# EAGLE design talking clock V1 (EAGLE 6.3)
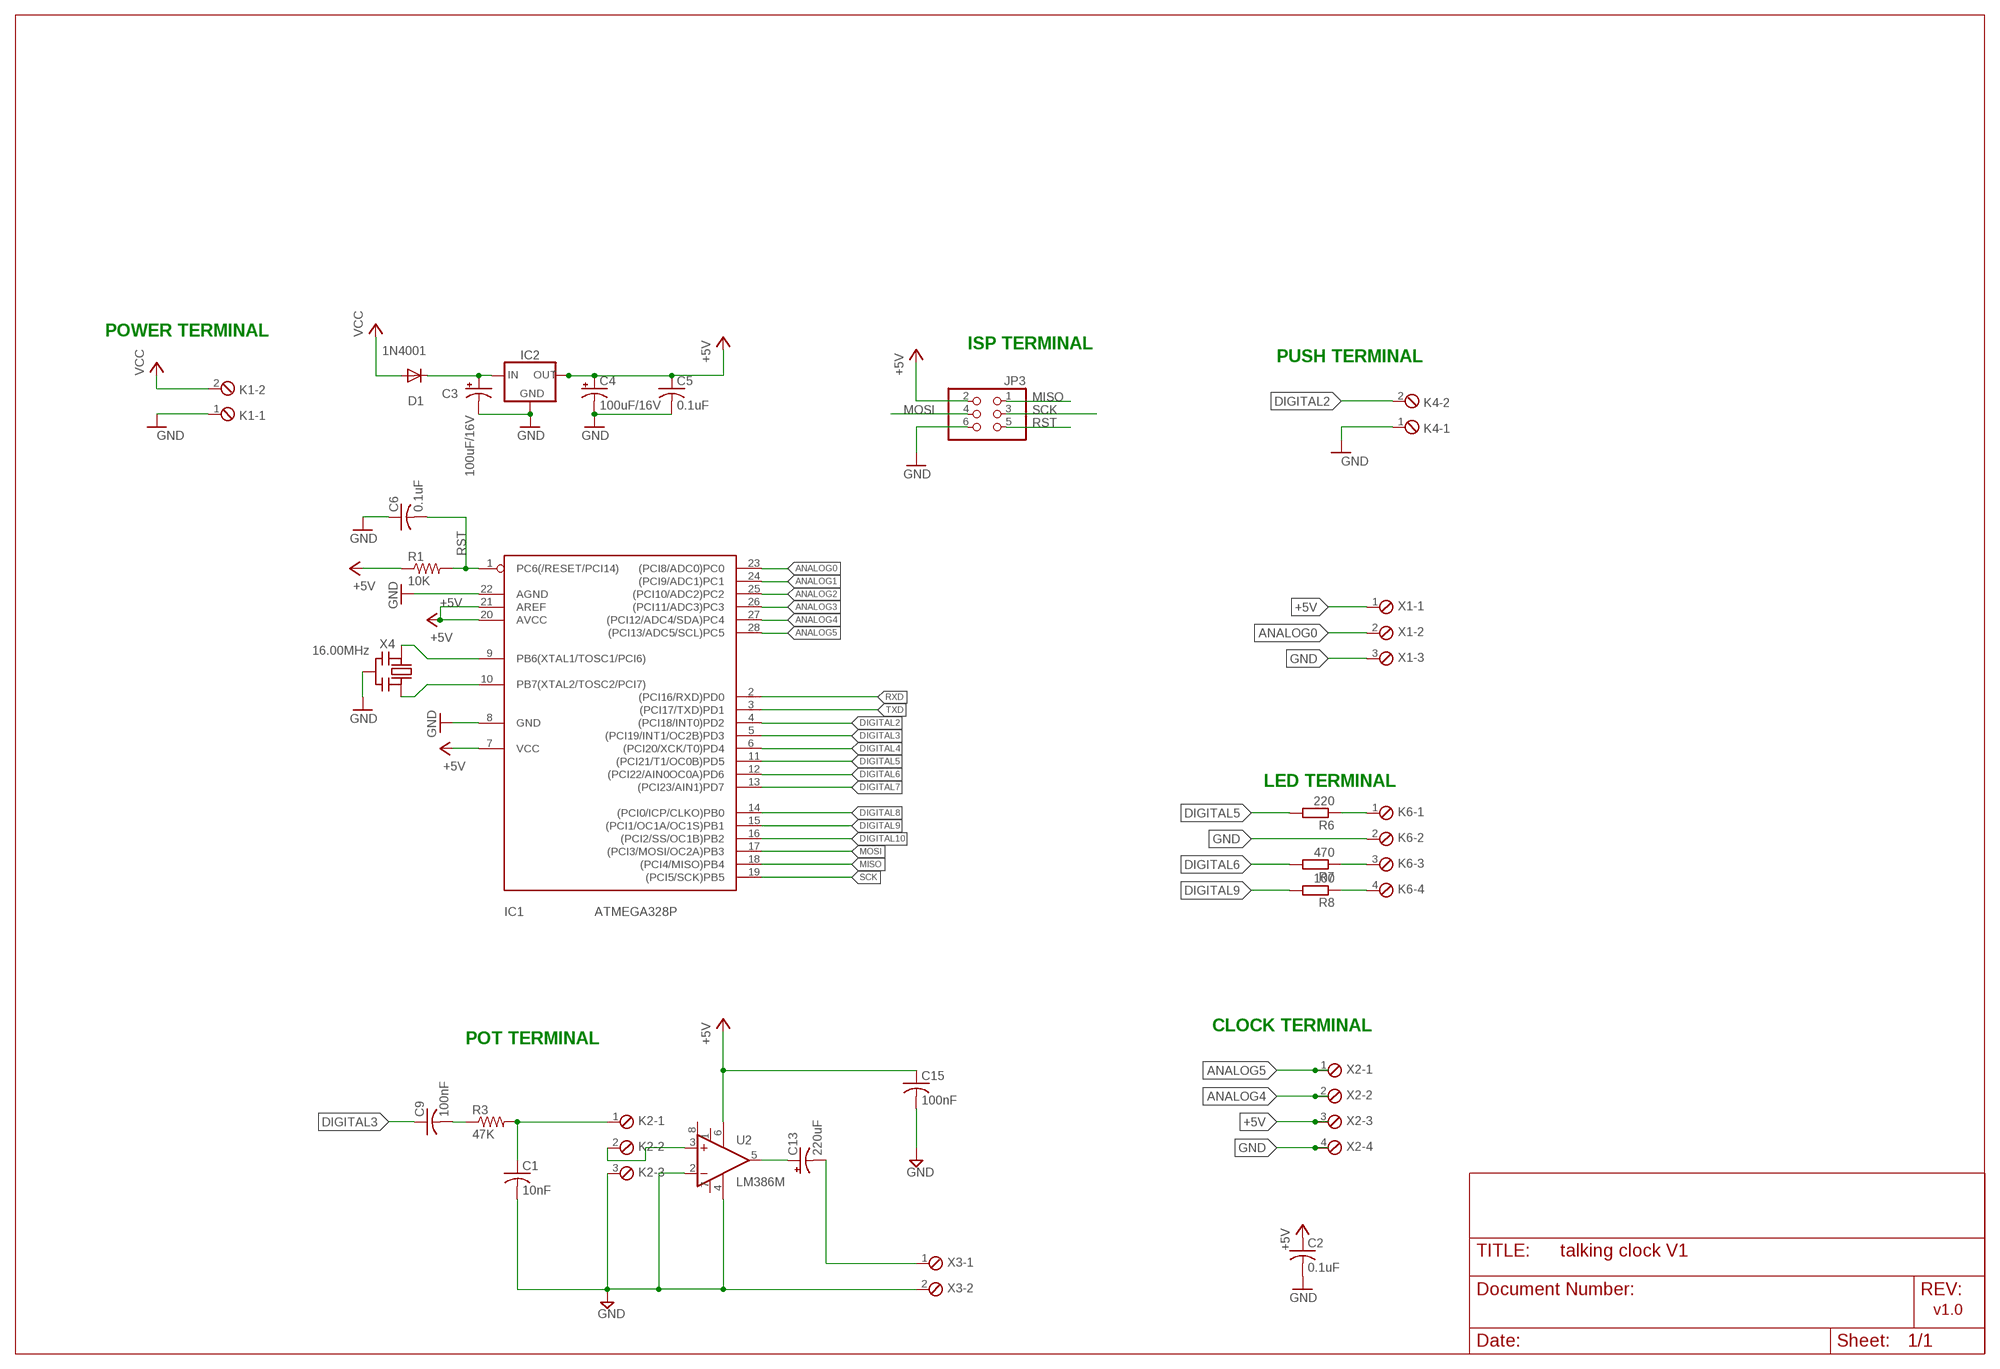
[diagram p0: schematic, sheet 1]

## Parts
C1  10nF  C-US050-025X075  [C050-025X075]
C2  0.1uF  C-US025-025X050  [C025-025X050]
C3  100uF/16V  CPOL-USE2.5-6  [E2,5-6]
C4  100uF/16V  CPOL-USE2.5-6  [E2,5-6]
C5  0.1uF  C-US025-025X050  [C025-025X050]
C6  0.1uF  C-US025-025X050  [C025-025X050]
C9  100nF  C-US025-025X050  [C025-025X050]
C13  220uF  CPOL-USE3.5-10  [E3,5-10]
C15  100nF  C-US025-025X050  [C025-025X050]
D1  1N4001  1N4004  [DO41-10]
IC1  ATMEGA328P  ATMEGA168PROUND  [DIL28/3]
IC2  78L05  78XXS  [78XXS]
JP3  PINHD-2X3  [2X03]
K1  MPT2  [2POL254]
K2  MPT3  [3POL254]
K4  MPT2  [2POL254]
K6  MPT4  [4POL254]
R1  10K  R-US_0207/10  [0207/10]
R3  47K  R-US_0207/10  [0207/10]
R6  220  R-EU_0207/10  [0207/10]
R7  470  R-EU_0207/10  [0207/10]
R8  100  R-EU_0207/10  [0207/10]
U2  LM386M  [SO08]
X1  MPT3  [3POL254]
X2  MPT4  [4POL254]
X3  MPT2  [2POL254]
X4  16.00MHz  CERMOSCILL  [CERM_OSC]

## Nets
+5V: C2.1 C4.+ C5.1 C15.1 IC1.7(VCC) IC1.20(AVCC) IC1.21(AREF) IC2.OUT JP3.2 R1.1 U2.6(V+) X1.1 X2.3
ANALOG0: IC1.23((PCI8/ADC0)PC0) X1.2
ANALOG1: IC1.24((PCI9/ADC1)PC1)
ANALOG2: IC1.25((PCI10/ADC2)PC2)
ANALOG3: IC1.26((PCI11/ADC3)PC3)
ANALOG4: IC1.27((PCI12/ADC4/SDA)PC4) X2.2
ANALOG5: IC1.28((PCI13/ADC5/SCL)PC5) X2.1
DIGITAL2: IC1.4((PCI18/INT0)PD2) K4.2
DIGITAL3: C9.1 IC1.5((PCI19/INT1/OC2B)PD3)
DIGITAL4: IC1.6((PCI20/XCK/T0)PD4)
DIGITAL5: IC1.11((PCI21/T1/OC0B)PD5) R6.2
DIGITAL6: IC1.12((PCI22/AIN0OC0A)PD6) R7.2
DIGITAL7: IC1.13((PCI23/AIN1)PD7)
DIGITAL8: IC1.14((PCI0/ICP/CLKO)PB0)
DIGITAL9: IC1.15((PCI1/OC1A/OC1S)PB1) R8.2
DIGITAL10: IC1.16((PCI2/SS/OC1B)PB2)
GND: C1.2 C2.2 C3.- C4.- C5.2 C6.1 C15.2 IC1.8(GND) IC1.22(AGND) IC2.GND JP3.6 K1.1 K2.3 K4.1 K6.2 U2.2(-IN) U2.4(V-) X1.3 X2.4 X3.2 X4.P$2(GND)
MISO: IC1.18((PCI4/MISO)PB4) JP3.1
MOSI: IC1.17((PCI3/MOSI/OC2A)PB3) JP3.4
N$3: C13.- X3.1
N$4: K2.2 U2.3(+IN)
N$5: C3.+ D1.C IC2.IN
N$6: IC1.9(PB6(XTAL1/TOSC1/PCI6)) X4.P$1(IN)
N$7: IC1.10(PB7(XTAL2/TOSC2/PCI7)) X4.P$3(OUT)
N$10: K6.4 R8.1
N$11: K6.3 R7.1
N$15: K6.1 R6.1
N$16: C9.2 R3.1
N$18: C1.1 K2.1 R3.2
N$25: C13.+ U2.5(OUT)
RST: C6.2 IC1.1(PC6(/RESET/PCI14)) JP3.5 R1.2
RXD: IC1.2((PCI16/RXD)PD0)
SCK: IC1.19((PCI5/SCK)PB5) JP3.3
TXD: IC1.3((PCI17/TXD)PD1)
VCC: D1.A K1.2
Unconnected: U2.1(GAIN+) U2.7(BYPASS) U2.8(GAIN-)

## Notes on the sheet
- POWER TERMINAL
- ISP TERMINAL
- PUSH TERMINAL
- LED TERMINAL
- CLOCK TERMINAL
- POT TERMINAL
- v1.0

## Library data of the parts
C1 C9 C15 = rcl:C-US: CAPACITOR, American symbol
C2 C5 C6 = minimidi:C-US: CAPACITOR, American symbol
C3 C4 = minimidi:CPOL-US: POLARIZED CAPACITOR, American symbol
C13 = rcl:CPOL-US: POLARIZED CAPACITOR, American symbol
D1 = minimidi:1N4004: DIODE general purpose rectifier, 1 A
IC1 = avr:ATMEGA168*P: MICROCONTROLLER 16 kBytes FLASH 1 kBytes SRAM 512 Bytes EEPROM USART 8-channel 10 bit ADC
IC2 = v-reg:78XXS: VOLTAGE REGULATOR
JP3 = pinhead-ez:PINHD-2X3: PIN HEADER
K1 K4 X3 = con-phoenix-254:MPT2: PHOENIX CONNECTOR; OC_FARNELL: unknown; OC_NEWARK: unknown
K2 X1 = con-phoenix-254:MPT3: PHOENIX CONNECTOR; OC_FARNELL: unknown; OC_NEWARK: unknown
K6 X2 = con-phoenix-254:MPT4: PHOENIX CONNECTOR; OC_FARNELL: unknown; OC_NEWARK: unknown
R1 = rcl-ez:R-US_: RESISTOR, American symbol
R3 = rcl:R-US_: RESISTOR, American symbol
R6-R8 = rcl:R-EU_: RESISTOR, European symbol
U2 = mes:LM386
X4 = digg:CERMOSCILL

## Board
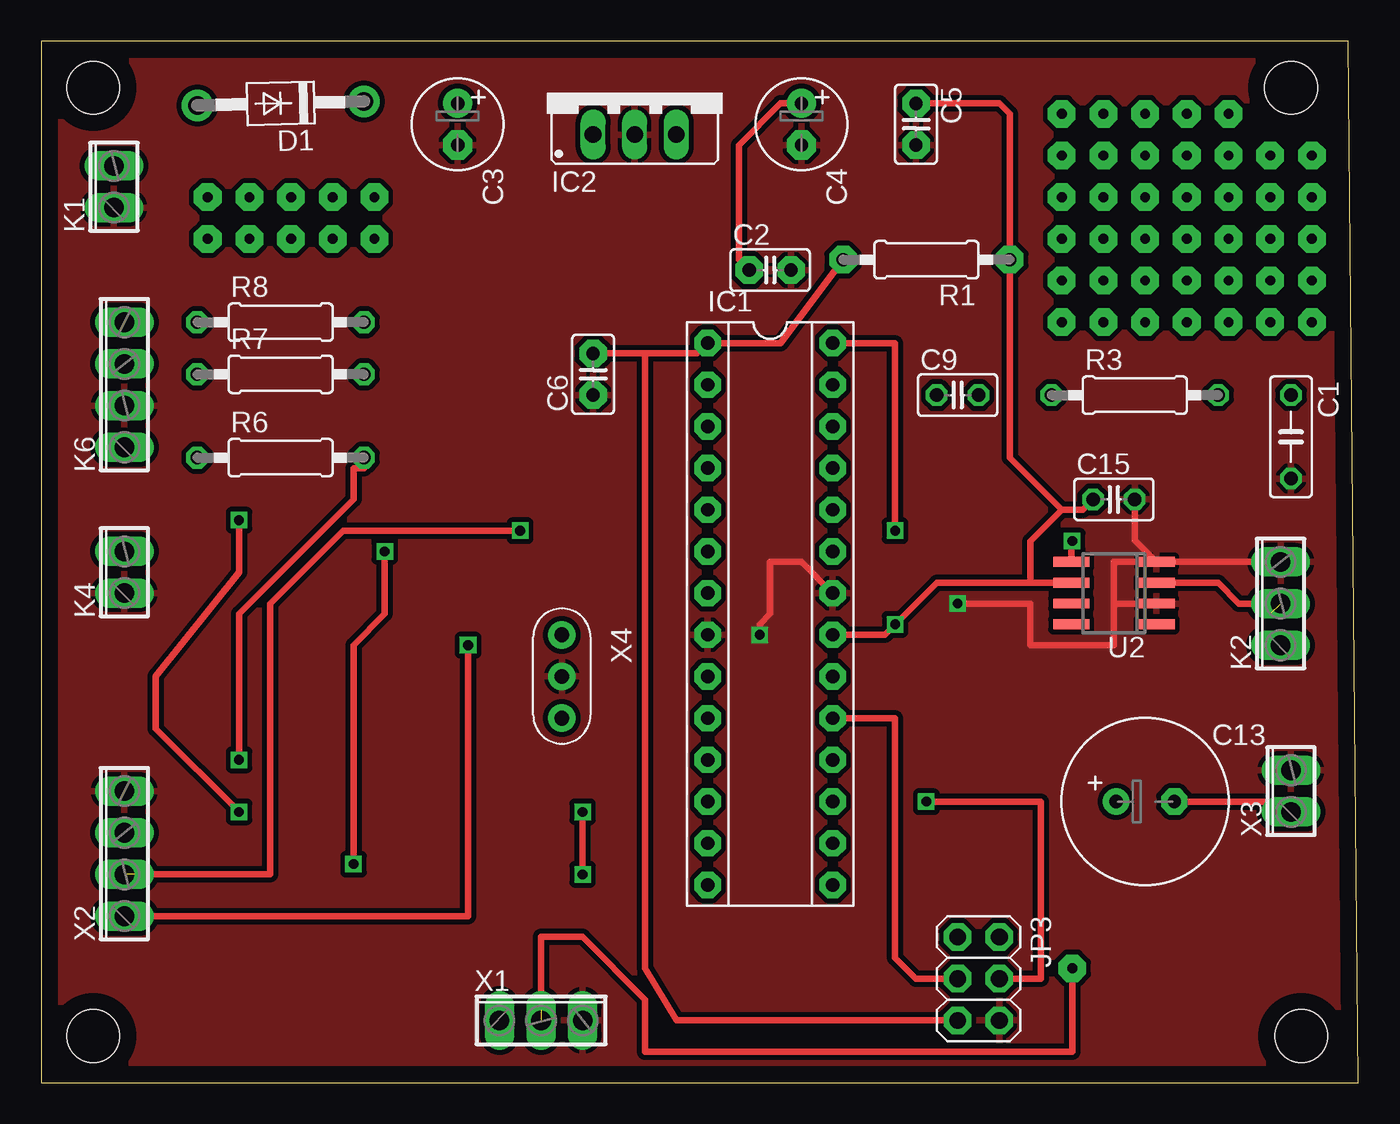
[diagram p1: board, top side]
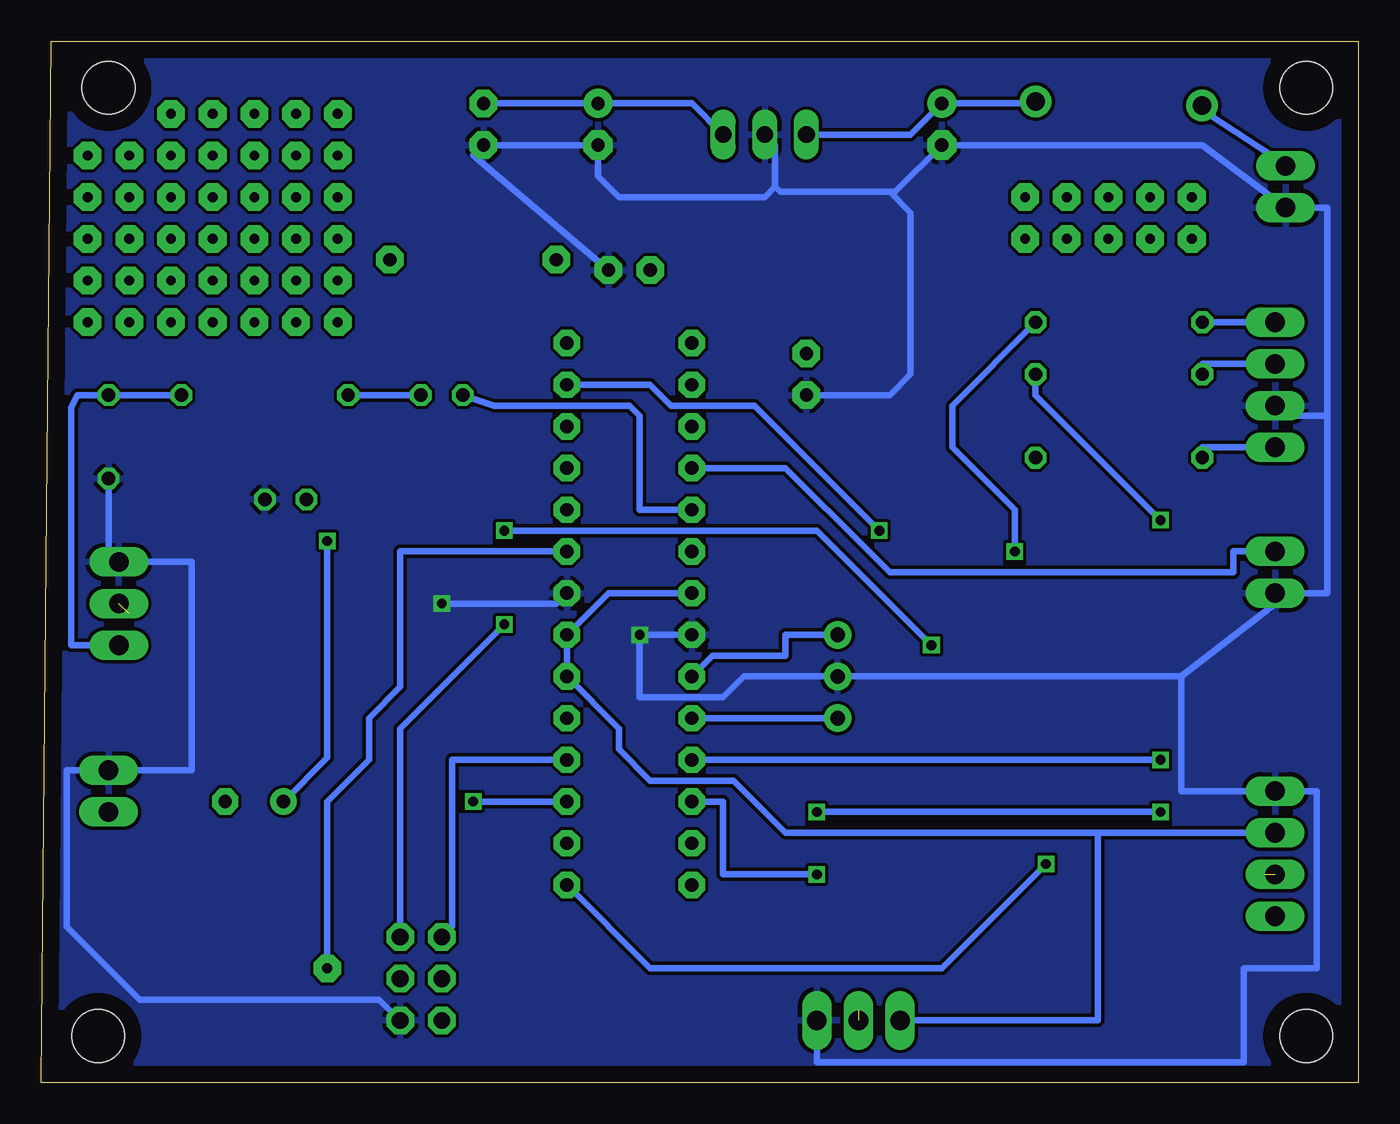
[diagram p2: board, bottom side, seen from below]

Size 80.31 x 63.49 mm. Coordinates in mm from the lower left corner, seen from the top.
Outline: 0,0 80.31,0 79.68,63.49 0,63.49 0,0
Copper layers (1*16): Top 0.035mm / dielectric 1.5mm / Bottom 0.035mm
Design rules "default": minimum track width 16mil, minimum drill 13mil, track to track 8mil, track to pad 8mil, pad to pad 8mil, via to via 8mil, smd to smd 8mil, copper to edge 40mil, drill to drill 8mil, minimum pad ring 10mil, minimum via ring 8mil, stop-mask expansion 4mil, vias tented up to drill 0mil, thermal gap 10mil
Holes 3.2 mm at 3.17,60.64 76.2,60.64 3.17,2.86 76.83,2.86

### Footprints (pad centres in the part's own frame; a part is rotated, then mirrored left to right if it is on the bottom)
C050-025X075 = drill 0.813 octagon: 1 -2.54,0; 2 2.54,0
C025-025X050 = drill 0.813 pad 1.676 octagon: 1 -1.27,0; 2 1.27,0
E2,5-6 = drill 0.813 pad 1.778: + -1.27,0 | drill 0.813 pad 1.778 octagon: - 1.27,0
C025-025X050' = drill 0.813 octagon: 1 -1.27,0; 2 1.27,0
E3,5-10 = drill 0.813 pad 1.6: + -1.778,0 | drill 0.813 pad 1.6 octagon: - 1.778,0
DO41-10 = drill 1.118 pad 1.93: A 5.08,0; C -5.08,0
DIL28/3 = drill 0.813 pad 1.6 octagon: 1 -16.51,-3.81; 2 -13.97,-3.81; 3 -11.43,-3.81; 4 -8.89,-3.81; 5 -6.35,-3.81; 6 -3.81,-3.81; 7 -1.27,-3.81; 8 1.27,-3.81; 9 3.81,-3.81; 10 6.35,-3.81; 11 8.89,-3.81; 12 11.43,-3.81; 13 13.97,-3.81; 14 16.51,-3.81; 15 16.51,3.81; 16 13.97,3.81; 17 11.43,3.81; 18 8.89,3.81; 19 6.35,3.81; 20 3.81,3.81; 21 1.27,3.81; 22 -1.27,3.81; 23 -3.81,3.81; 24 -6.35,3.81; 25 -8.89,3.81; 26 -11.43,3.81; 27 -13.97,3.81; 28 -16.51,3.81
78XXS = drill 1.016 long: GND 0,-2.54; IN -2.54,-2.54; OUT 2.54,-2.54
2X03 = drill 1.016 pad 1.676 octagon: 1 -2.54,-1.27; 2 -2.54,1.27; 3 0,-1.27; 4 0,1.27; 5 2.54,-1.27; 6 2.54,1.27
2POL254 = drill 1.2 long: 1 -1.27,0; 2 1.27,0
3POL254 = drill 1.2 long: 1 -2.54,0; 2 0,0; 3 2.54,0
4POL254 = drill 1.2 long: 1 -3.81,0; 2 -1.27,0; 3 1.27,0; 4 3.81,0
0207/10 = drill 0.813 pad 1.676 octagon: 1 -5.08,0; 2 5.08,0
0207/10' = drill 0.813 octagon: 1 -5.08,0; 2 5.08,0
SO08 = smd 0.6 x 2.2: 1 -1.905,-2.6; 2 -0.635,-2.6; 3 0.635,-2.6; 4 1.905,-2.6; 5 1.905,2.6; 6 0.635,2.6; 7 -0.635,2.6; 8 -1.905,2.6
CERM_OSC = drill 0.9 pad 1.676: P$1 -2.54,0; P$2 0,0; P$3 2.54,0

### Placement (x,y rotation side)
C1  76.2,39.37 270 top
C2  44.45,49.53 0 top
C3  25.4,58.42 270 top
C4  46.35,58.42 270 top
C5  53.34,58.42 270 top
C6  33.66,43.18 90 top
C9  100nF  [C025-025X050']  55.88,41.91 0 top
C13  67.31,17.14 0 top
C15  100nF  [C025-025X050']  65.41,35.56 0 top
D1  14.61,59.69 181.4 top
IC1  44.45,28.57 270 top
IC2  36.2,60.33 0 top
JP3  57.15,6.35 270 top
K1  4.45,54.61 90 top
K2  75.56,29.21 90 top
K4  5.08,31.11 90 top
K6  5.08,42.55 90 top
R1  53.98,50.16 180 top
R3  47K  [0207/10']  66.67,41.91 0 top
R6  220  [0207/10']  14.61,38.1 0 top
R7  470  [0207/10']  14.61,43.18 0 top
R8  100  [0207/10']  14.61,46.35 0 top
U2  65.41,29.84 90 top
X1  30.48,3.81 0 top
X2  5.08,13.97 90 top
X3  76.2,17.78 90 top
X4  31.75,24.77 270 top

### Tracks (layer width: path | path; a pad name or v marks a point on that pad's centre or on a via)
+5V  (via drill 0.6)
  Top 0.406: U2.6 60.33,30.48 | 60.33,30.48 60.33,33.02 62.23,34.92 | 62.23,34.92 63.5,34.92 C15.1 | 60.33,30.48 54.61,30.48 52.39,28.26 | 52.39,28.26 v52.07,27.94 | v52.07,27.94 51.44,27.3 IC1.21 | 62.23,34.92 59.05,38.1 59.05,46.99 59.05,48.26 R1.1 59.05,59.05 58.42,59.69 C5.1 | C4.+ 45.09,59.69 42.55,57.15 42.55,50.16 C2.1 | v52.07,27.94 52.39,28.26
  Bottom 0.406: IC2.OUT 40.64,59.69 C4.+ C5.1 | IC1.7 45.72,29.84 IC1.21 IC1.20 45.09,21.59 45.09,20.32 43.18,18.41 38.1,18.41 34.92,15.24 15.88,15.24 | JP3.2 58.42,21.59 v52.07,27.94 | X2.3 15.88,15.24 | X1.1 15.88,3.81 15.88,15.24
ANALOG0  (via drill 0.6 pad 1.68)  (1 unrouted)
  Top 0.406: v62.87,6.99 62.87,1.91 36.83,1.91 36.83,5.08 33.02,8.89 30.48,8.89 30.48,4.45
  Bottom 0.406: IC1.23 57.78,32.38 58.42,32.38 58.42,25.4 58.42,24.13 60.33,22.23 60.33,19.68 62.87,17.14 v62.87,6.99
ANALOG4  (via drill 0.6)  (1 unrouted)
  Top 0.406: v29.21,33.66 18.41,33.66 13.97,29.21 13.97,14.61 13.97,12.7 10.16,12.7 9.53,12.7 5.71,12.7
  Bottom 0.406: IC1.27 43.18,42.55 41.91,41.27 36.83,41.27 32.38,36.83 v29.21,33.66
ANALOG5  (via drill 0.6)
  Top 0.406: IC1.28 52.07,45.09 v52.07,33.66 | v26.04,26.67 26.04,10.16 X2.1
  Bottom 0.406: v52.07,33.66 33.02,33.66 v26.04,26.67
DIGITAL2
  Bottom 0.406: K4.2 7.62,32.38 7.62,31.11 28.57,31.11 29.84,32.38 34.92,37.47 IC1.4
DIGITAL3
  Bottom 0.406: C9.1 52.7,41.27 44.45,41.27 43.81,40.64 43.81,34.92 IC1.5
DIGITAL5  (via drill 0.6)
  Top 0.406: R6.2 19.68,37.47 19.05,37.47 19.05,35.56 12.06,28.57 v12.06,19.68
  Bottom 0.406: v12.06,19.68 IC1.11
DIGITAL6  (via drill 0.6)
  Top 0.406: v12.06,34.29 12.06,31.11 6.99,24.77 6.99,21.59 v12.06,16.51 | v33.02,16.51 v33.02,12.7
  Bottom 0.406: R7.2 19.68,41.91 v12.06,34.29 | v12.06,16.51 v33.02,16.51 | v33.02,12.7 38.73,12.7 38.73,17.14 IC1.12
DIGITAL9  (via drill 0.6)
  Top 0.406: v19.05,13.34 19.05,26.67 20.95,28.57 v20.95,32.38
  Bottom 0.406: IC1.15 43.18,6.99 25.4,6.99 v19.05,13.34 | v20.95,32.38 20.95,34.92 24.77,38.73 24.77,41.27 R8.2
GND  (via drill 0.6)
  Top 0.406: 65.41,29.21 65.41,31.75 67.37,31.75 | v43.81,27.3 43.81,27.94 44.45,28.57 44.45,31.75 46.35,31.75 IC1.22 | 65.41,29.21 65.41,26.67 60.33,26.67 60.33,29.21 v55.88,29.21 | C15.2 66.67,33.08 U2.4 | U2.4 74.93,31.75 | U2.4 67.94,31.75 | U2.2 65.41,29.21
  Bottom 0.406: IC2.GND 35.56,57.15 35.56,54.61 | 35.56,54.61 35.24,54.29 28.57,54.29 | 28.57,54.29 28.26,54.29 C3.- 9.53,57.15 K1.1 1.91,53.34 1.91,40.64 | C4.- C5.2 53.98,56.52 C2.2 | 5.08,40.64 1.91,40.64 | 1.91,40.64 1.91,29.84 K4.1 | 5.71,29.84 K4.1 | K4.1 5.08,29.21 10.79,24.77 | 10.79,24.77 X4.P$2 37.47,24.77 38.73,23.5 43.81,23.5 v43.81,27.3 IC1.8 | 35.56,54.61 36.2,53.98 45.09,53.98 46.35,55.24 46.35,56.52 | C6.1 28.57,41.91 27.3,43.18 27.3,53.02 28.57,54.29 | v55.88,29.21 48.9,29.21 IC1.22 | C1.2 76.2,32.38 K2.3 71.12,31.75 71.12,19.05 X3.2 78.74,19.05 78.74,9.53 74.3,5.08 59.69,5.08 JP3.6 | 10.79,24.77 10.79,17.78 X2.4 | X1.3 33.02,1.27 6.99,1.27 6.99,6.99 2.54,6.99 2.54,17.78 4.45,17.78
  pour Top (isolate 0.305): 0,63.5 79.68,63.49 80.31,0 0,0
  pour Bottom: 0,63.5 80.01,63.5 80.01,0 0,0
MISO
  Bottom 0.406: IC1.18 55.24,19.68 55.24,9.53 JP3.1
MOSI  (via drill 0.6)
  Top 0.406: 57.78,6.35 JP3.4 60.96,6.35 60.96,17.14 v53.98,17.14
  Bottom 0.406: IC1.17 v53.98,17.14
N$1  (via drill 0.6 pad 1.68)
  other vias: 62.23,59.05
N$2  (via drill 0.6 pad 1.68)
  other vias: 64.77,59.05
N$3
  Top 0.406: C13.- 75.56,17.14 X3.1
N$4  (1 unrouted)
  Top 0.406: U2.3 71.75,30.48 73.03,29.21 74.3,29.21 74.93,28.57
N$5
  Bottom 0.406: D1.C 20.19,59.69 C3.+ 27.3,57.78 IC2.IN
N$6
  Bottom 0.406: X4.P$1 34.92,27.3 34.92,26.04 39.37,26.04 IC1.9
N$7
  Bottom 0.406: X4.P$3 33.66,22.23 IC1.10
N$8  (via drill 0.6 pad 1.68)
  other vias: 67.31,59.05
N$9  (via drill 0.6 pad 1.68)
  other vias: 69.85,59.05
N$10
  Bottom 0.406: K6.4 R8.1
N$11
  Bottom 0.406: K6.3 9.53,43.81 R7.1
N$12  (via drill 0.6 pad 1.68)
  other vias: 72.39,59.05
N$13  (via drill 0.6 pad 1.68)
  other vias: 62.23,56.52
N$14  (via drill 0.6 pad 1.68)
  other vias: 62.23,53.98
N$15
  Bottom 0.406: K6.1 9.53,38.73 R6.1
N$16
  Bottom 0.406: C9.2 R3.1
N$17  (via drill 0.6 pad 1.68)
  other vias: 62.23,51.44
N$18
  Bottom 0.406: K2.1 78.49,26.67 78.49,41.15 78.11,41.91 C1.1 R3.2
N$19  (via drill 0.6 pad 1.68)
  other vias: 62.23,48.9
N$20  (via drill 0.6 pad 1.68)
  other vias: 62.23,46.35
N$21  (via drill 0.6 pad 1.68)
  other vias: 64.77,56.52
N$22  (via drill 0.6 pad 1.68)
  other vias: 64.77,53.98
N$23  (via drill 0.6 pad 1.68)
  other vias: 64.77,51.44
N$24  (via drill 0.6 pad 1.68)
  other vias: 64.77,48.9
N$25  (via drill 0.6)
  Top 0.406: U2.5 62.8,32.96 v62.87,33.02
  Bottom 0.406: v62.87,33.02 62.87,19.81 C13.+
N$26  (via drill 0.6 pad 1.68)
  other vias: 64.77,46.35
N$27  (via drill 0.6 pad 1.68)
  other vias: 67.31,46.35
N$28  (via drill 0.6 pad 1.68)
  other vias: 67.31,48.9
N$29  (via drill 0.6 pad 1.68)
  other vias: 67.31,51.44
N$30  (via drill 0.6 pad 1.68)
  other vias: 67.31,53.98
N$31  (via drill 0.6 pad 1.68)
  other vias: 67.31,56.52
N$32  (via drill 0.6 pad 1.68)
  other vias: 69.85,56.52
N$33  (via drill 0.6 pad 1.68)
  other vias: 72.39,56.52
N$34  (via drill 0.6 pad 1.68)
  other vias: 74.93,56.52
N$35  (via drill 0.6 pad 1.68)
  other vias: 77.47,56.52
N$36  (via drill 0.6 pad 1.68)
  other vias: 77.47,53.98
N$37  (via drill 0.6 pad 1.68)
  other vias: 74.93,53.98
N$38  (via drill 0.6 pad 1.68)
  other vias: 72.39,53.98
N$39  (via drill 0.6 pad 1.68)
  other vias: 69.85,53.98
N$40  (via drill 0.6 pad 1.68)
  other vias: 69.85,51.44
N$41  (via drill 0.6 pad 1.68)
  other vias: 72.39,51.44
N$42  (via drill 0.6 pad 1.68)
  other vias: 74.93,51.44
N$43  (via drill 0.6 pad 1.68)
  other vias: 77.47,51.44
N$44  (via drill 0.6 pad 1.68)
  other vias: 77.47,48.9
N$45  (via drill 0.6 pad 1.68)
  other vias: 74.93,48.9
N$46  (via drill 0.6 pad 1.68)
  other vias: 72.39,48.9
N$47  (via drill 0.6 pad 1.68)
  other vias: 69.85,48.9
N$48  (via drill 0.6 pad 1.68)
  other vias: 69.85,46.35
N$49  (via drill 0.6 pad 1.68)
  other vias: 72.39,46.35
N$50  (via drill 0.6 pad 1.68)
  other vias: 74.93,46.35
N$51  (via drill 0.6 pad 1.68)
  other vias: 77.47,46.35
N$52  (via drill 0.6 pad 1.68)
  other vias: 10.16,53.98
N$53  (via drill 0.6 pad 1.68)
  other vias: 12.7,53.98
N$54  (via drill 0.6 pad 1.68)
  other vias: 15.24,53.98
N$55  (via drill 0.6 pad 1.68)
  other vias: 17.78,53.98
N$56  (via drill 0.6 pad 1.68)
  other vias: 20.32,53.98
N$57  (via drill 0.6 pad 1.68)
  other vias: 20.32,51.44
N$58  (via drill 0.6 pad 1.68)
  other vias: 17.78,51.44
N$59  (via drill 0.6 pad 1.68)
  other vias: 15.24,51.44
N$60  (via drill 0.6 pad 1.68)
  other vias: 12.7,51.44
N$61  (via drill 0.6 pad 1.68)
  other vias: 10.16,51.44
RST
  Top 0.406: C6.2 36.83,44.45 | 36.83,44.45 40.01,44.45 IC1.1 45.09,45.09 R1.2 | JP3.5 38.73,3.81 36.83,6.99 36.83,44.45
SCK
  Top 0.406: IC1.19 52.07,22.23 52.07,7.62 53.34,6.35 JP3.3
VCC
  Bottom 0.406: 8.89,59.05 9.01,58.93 | 9.01,58.93 D1.A | 9.01,58.93 5.33,56.52 K1.2